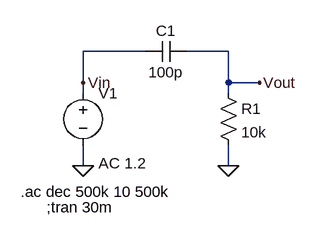
[diagram p0: schematic 4-2.asc]
4-2.asc, the LTspice schematic file:
Version 4
SHEET 1 880 680
WIRE 128 96 32 96
WIRE 256 96 192 96
WIRE 32 144 32 96
WIRE 256 144 256 96
WIRE 304 144 256 144
WIRE 32 160 32 144
WIRE 256 160 256 144
WIRE 32 272 32 240
WIRE 256 272 256 240
FLAG 32 272 0
FLAG 256 272 0
FLAG 304 144 Vout
FLAG 32 144 Vin
SYMBOL res 240 144 R0
SYMATTR InstName R1
SYMATTR Value 10k
SYMBOL cap 192 80 R90
WINDOW 0 0 32 VBottom 2
WINDOW 3 32 32 VTop 2
SYMATTR InstName C1
SYMATTR Value 100p
SYMBOL voltage 32 144 R0
WINDOW 123 24 124 Left 2
WINDOW 39 0 0 Left 0
SYMATTR Value2 AC 1.2
SYMATTR InstName V1
SYMATTR Value ""
TEXT -64 312 Left 2 !.ac dec 500k 10 500k
TEXT -24 336 Left 2 !;tran 30m

The netlist it stands for:
* 4-2.asc
R1 Vout 0 10k
C1 Vout Vin 100p
V1 Vin 0 AC 1.2
.ac dec 500k 10 500k
;tran 30m
.backanno
.end